# EAGLE design Relais2-N_Channel_MOSFET-V002 (EAGLE 7.7.0)
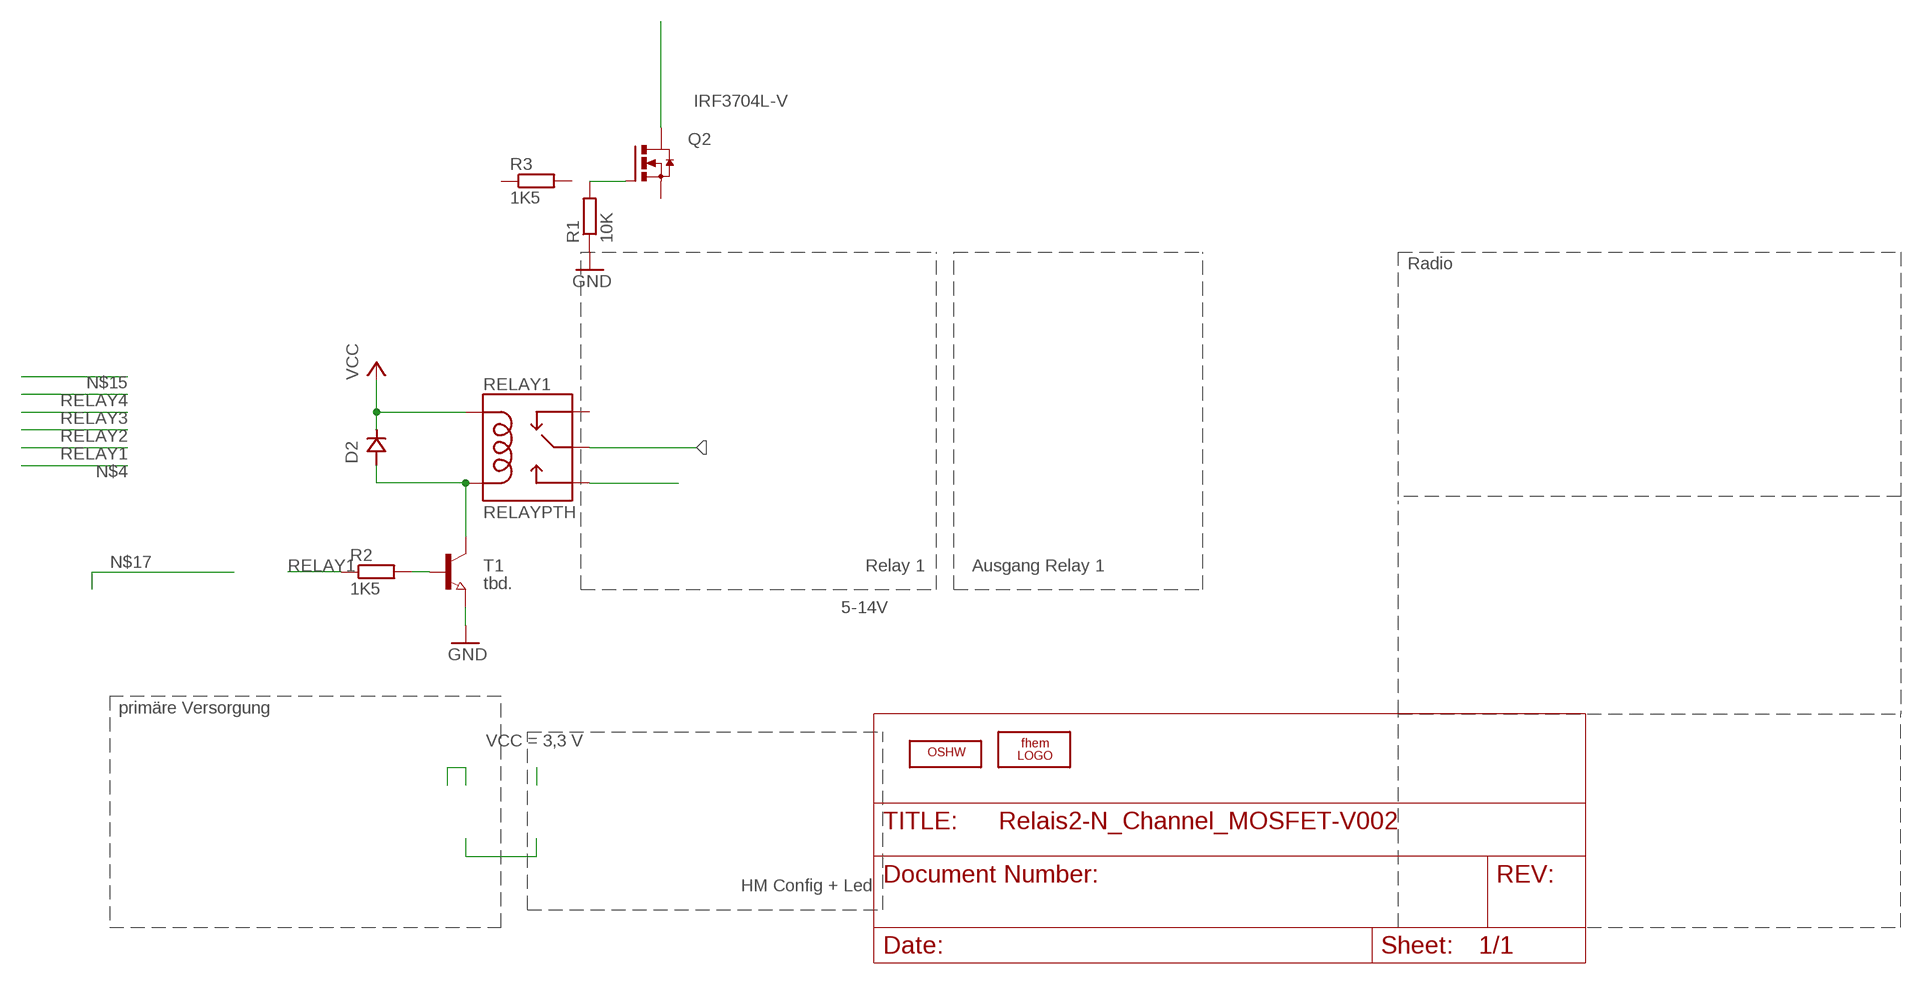
[diagram p0: schematic, sheet 1]

## Parts
D2  SS14  [DO214]
LOGO2  LOGO_OSHWX0070  [OSHW_6X70]
Q2  IRF3704L-V  [TO262-V]
R1  10K  R0805_SMALL_GAP  [R0805_SMALL_GAP]
R2  1K5  R0805_SMALL_GAP  [R0805_SMALL_GAP]
R3  1K5  R0805_SMALL_GAP  [R0805_SMALL_GAP]
RELAY1  RELAYPTH  [SRD-05VDC-SL-C]
T1  tbd.  NPN-TRANSISTOR_SOT89  [SOT89]
U$2  LOGO_FHEMSTOP  [LOGO_FHEM_3X3_STOP]

## Nets
GND: R1.1 T1.3(E)
N$6: Q2.1(G) R1.2
N$7: Q2.2(D)
N$13: D2.ANODE RELAY1.COIL0 T1.2(C)
N$16: R2.2 T1.1(B)
RELAY1: R2.1
SCHALT: RELAY1.SWOPEN
SW-INPUT: RELAY1.SWCOMMON
VCC: D2.CATHODE RELAY1.COIL1
Unconnected: Q2.3(S) R3.1 R3.2 RELAY1.SWCLOSED(SWCLOSE)

## Notes on the sheet
- Radio
- Relay 1 | Ausgang Relay 1
- 5-14V
- primäre Versorgung
- VCC = 3,3 V
- HM Config + Led

## Library data of the parts
D2 = ihpcb-diode:SS14
LOGO2 = mechanics:LOGO_OSHW: Open-Source-Hardware Logo
Q2 = transistor-power:IRF3704: SMPS MOSFET HEXFET® Power MOSFET Source: http://www.irf.com/product-info/datasheets/data/irf3704.pdf
R1-R3 = Hexenmeister:R0805_SMALL_GAP: SMD Resistor (0805) mit einer schmalleren Lücke (kann als Lötjumper erwendet werden)
RELAY1 = SRD-05VDC-SL-C:RELAY: SPDT relay (COM-00101)
T1 = semicon-smd-ipc:NPN-TRANSISTOR_: NPN TRANSISTOR
U$2 = logo:LOGO_FHEM: fhem logo for PCB

## Board
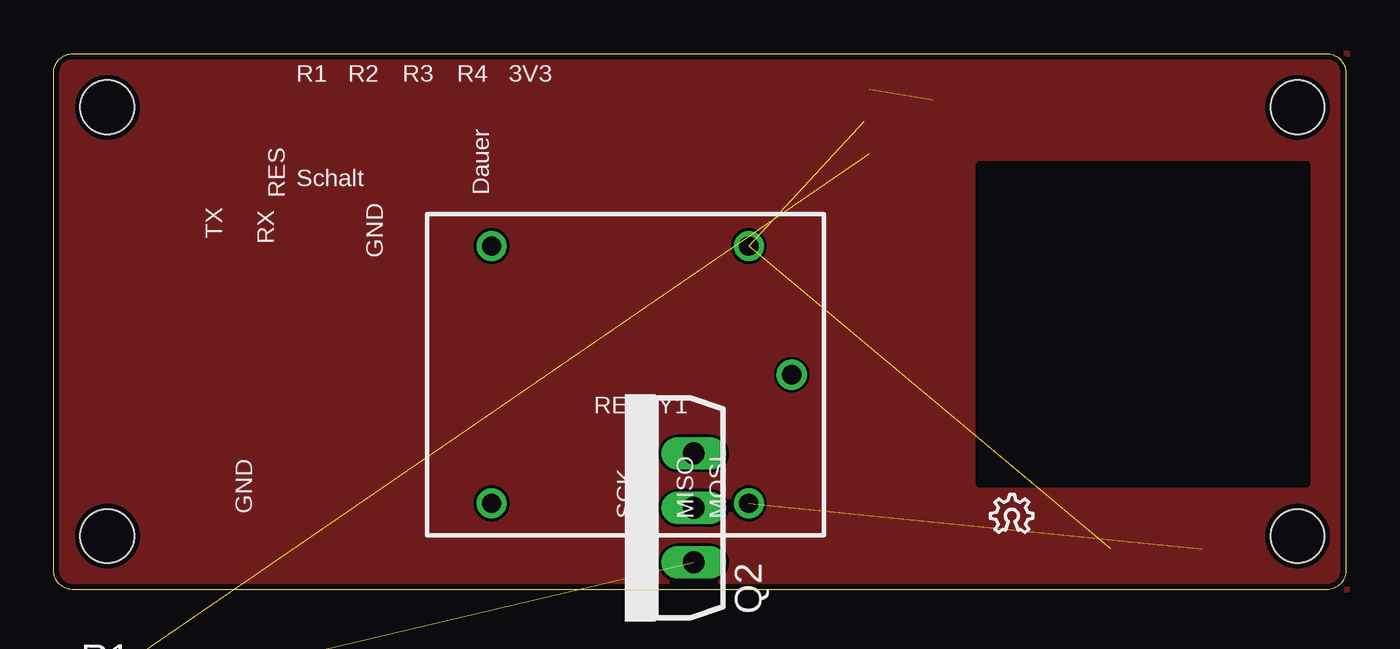
[diagram p1: board, top side]
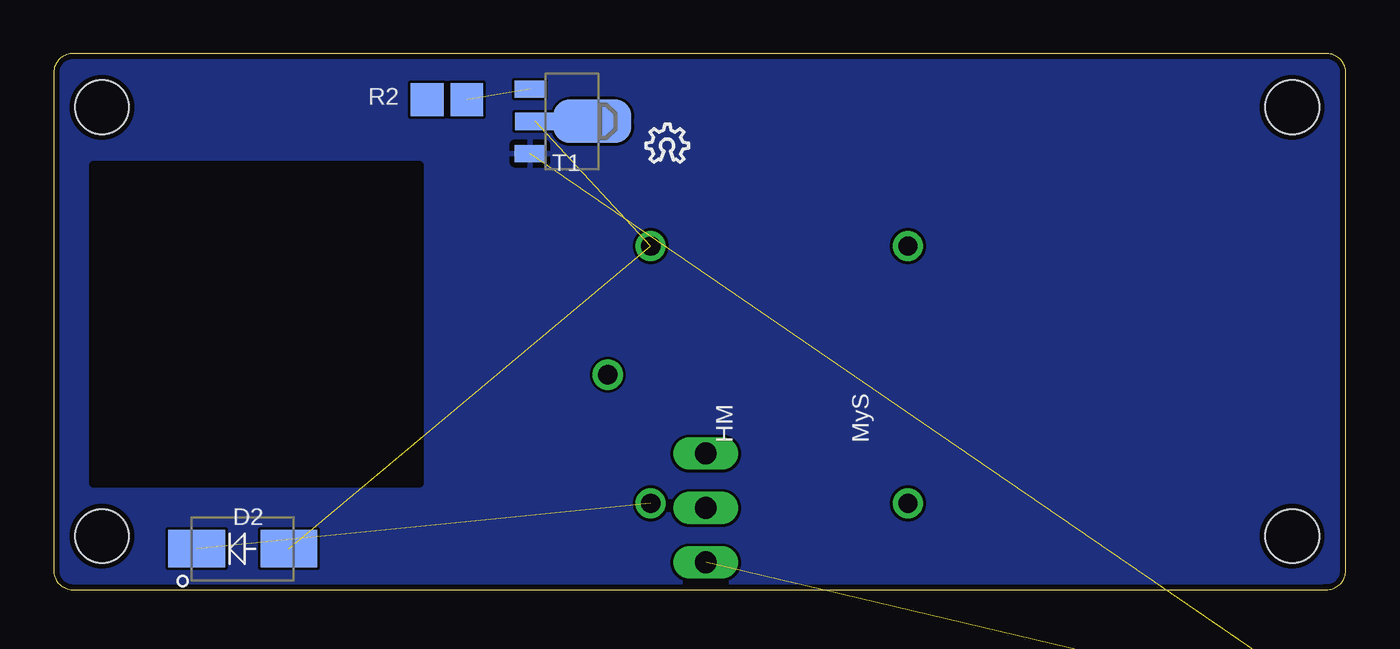
[diagram p2: board, bottom side, seen from below]

Size 60.26 x 25.01 mm. Coordinates in mm from the lower left corner, seen from the top.
Outline: 0.01,0.81 0.01,24.01 arc-90 0.81,25.01 59.26,25.01 arc-90 60.26,24.21 60.26,1.01 arc-90 59.46,0.01 1.01,0.01 arc-90 0.01,0.81
Copper layers (1*16): Top 0.035mm / dielectric 1.5mm / Bottom 0.035mm
Design rules "dirtypcbs_v1.0": minimum track width 5mil, minimum drill 12mil, track to track 5mil, track to pad 5mil, pad to pad 5mil, via to via 5mil, smd to smd 0mil, copper to edge 10mil, drill to drill 10mil, minimum pad ring 10mil, minimum via ring 6mil, stop-mask expansion 2mil, vias tented up to drill 25mil, thermal gap 10mil
Holes 2.5 mm at 2.51,2.51 58.01,2.51 58.01,22.51 2.51,22.51

### Footprints (pad centres in the part's own frame; a part is rotated, then mirrored left to right if it is on the bottom)
DO214 = smd 2.65 x 1.75: ANODE -2.15,0; CATHODE 2.15,0
TO262-V = drill 1.016 long: 1 -2.54,0; 2 0,0; 3 2.54,0
R0805_SMALL_GAP = smd 1.524 x 1.524: 1 -0.927,0; 2 0.927,0
SRD-05VDC-SL-C = drill 0.9: COIL0 -5.39,-6.12; COIL1 -5.39,5.88; SWCLOSED 6.61,-6.12; SWCOMMON -7.39,-0.12; SWOPEN 6.61,5.88
SOT89 = smd 0.8 x 1.4: 1 -1.499,-1.981; 3 1.499,-1.981 | smd 0.8 x 1.9: 2 0,-1.727 | smd 2.032 x 3.65: 2@1 0,0.94

### Placement (x,y rotation side)
D2  51.44,1.91 180 bottom
LOGO1  LOGO_OSHWX0070  [OSHW_6X70]  43.69,2.67 0 top
LOGO2  32.64,19.94 0 bottom
Q2  29.85,3.82 90 top
R1  1.91,-5.07 0 top  (outside the outline)
R2  41.92,22.87 0 bottom
R3  1.91,-11.42 0 top  (outside the outline)
RELAY1  27.03,9.91 180 top
T1  36.07,21.85 270 bottom
U$2  36.84,17.79 0 top

### Tracks (layer width: path | path; a pad name or v marks a point on that pad's centre or on a via)
GND  (1 unrouted)
  pour Bottom: 0.01,0.01 0.01,25.02 60.33,25.02 60.33,0.01
  pour Top: 0.01,0.01 0.01,25.02 60.33,25.02 60.33,0.01
  cutout Top: 58.43,19.82 43.19,19.82 43.19,4.96 58.43,4.96
  cutout Bottom: 58.43,19.82 43.19,19.82 43.19,4.96 58.43,4.96
N$6  (1 unrouted)
N$13  (2 unrouted)
N$16  (1 unrouted)
VCC  (1 unrouted)

### Text on the board
tNames: R1 | R2 | R3 | R4 | 3V3 | Schalt | RES | Dauer | TX | RX | GND | GND | SCK | MISO | MOSI
bNames: MyS | HM
tStop: HM-MYS-RELAY v1.1
bStop: HM-MYS-RELAY v1.1